# Altium schematic sheet Multi_LT_circuit.SchDoc
size A3; SheetNumber: 3; SheetTotal: 3
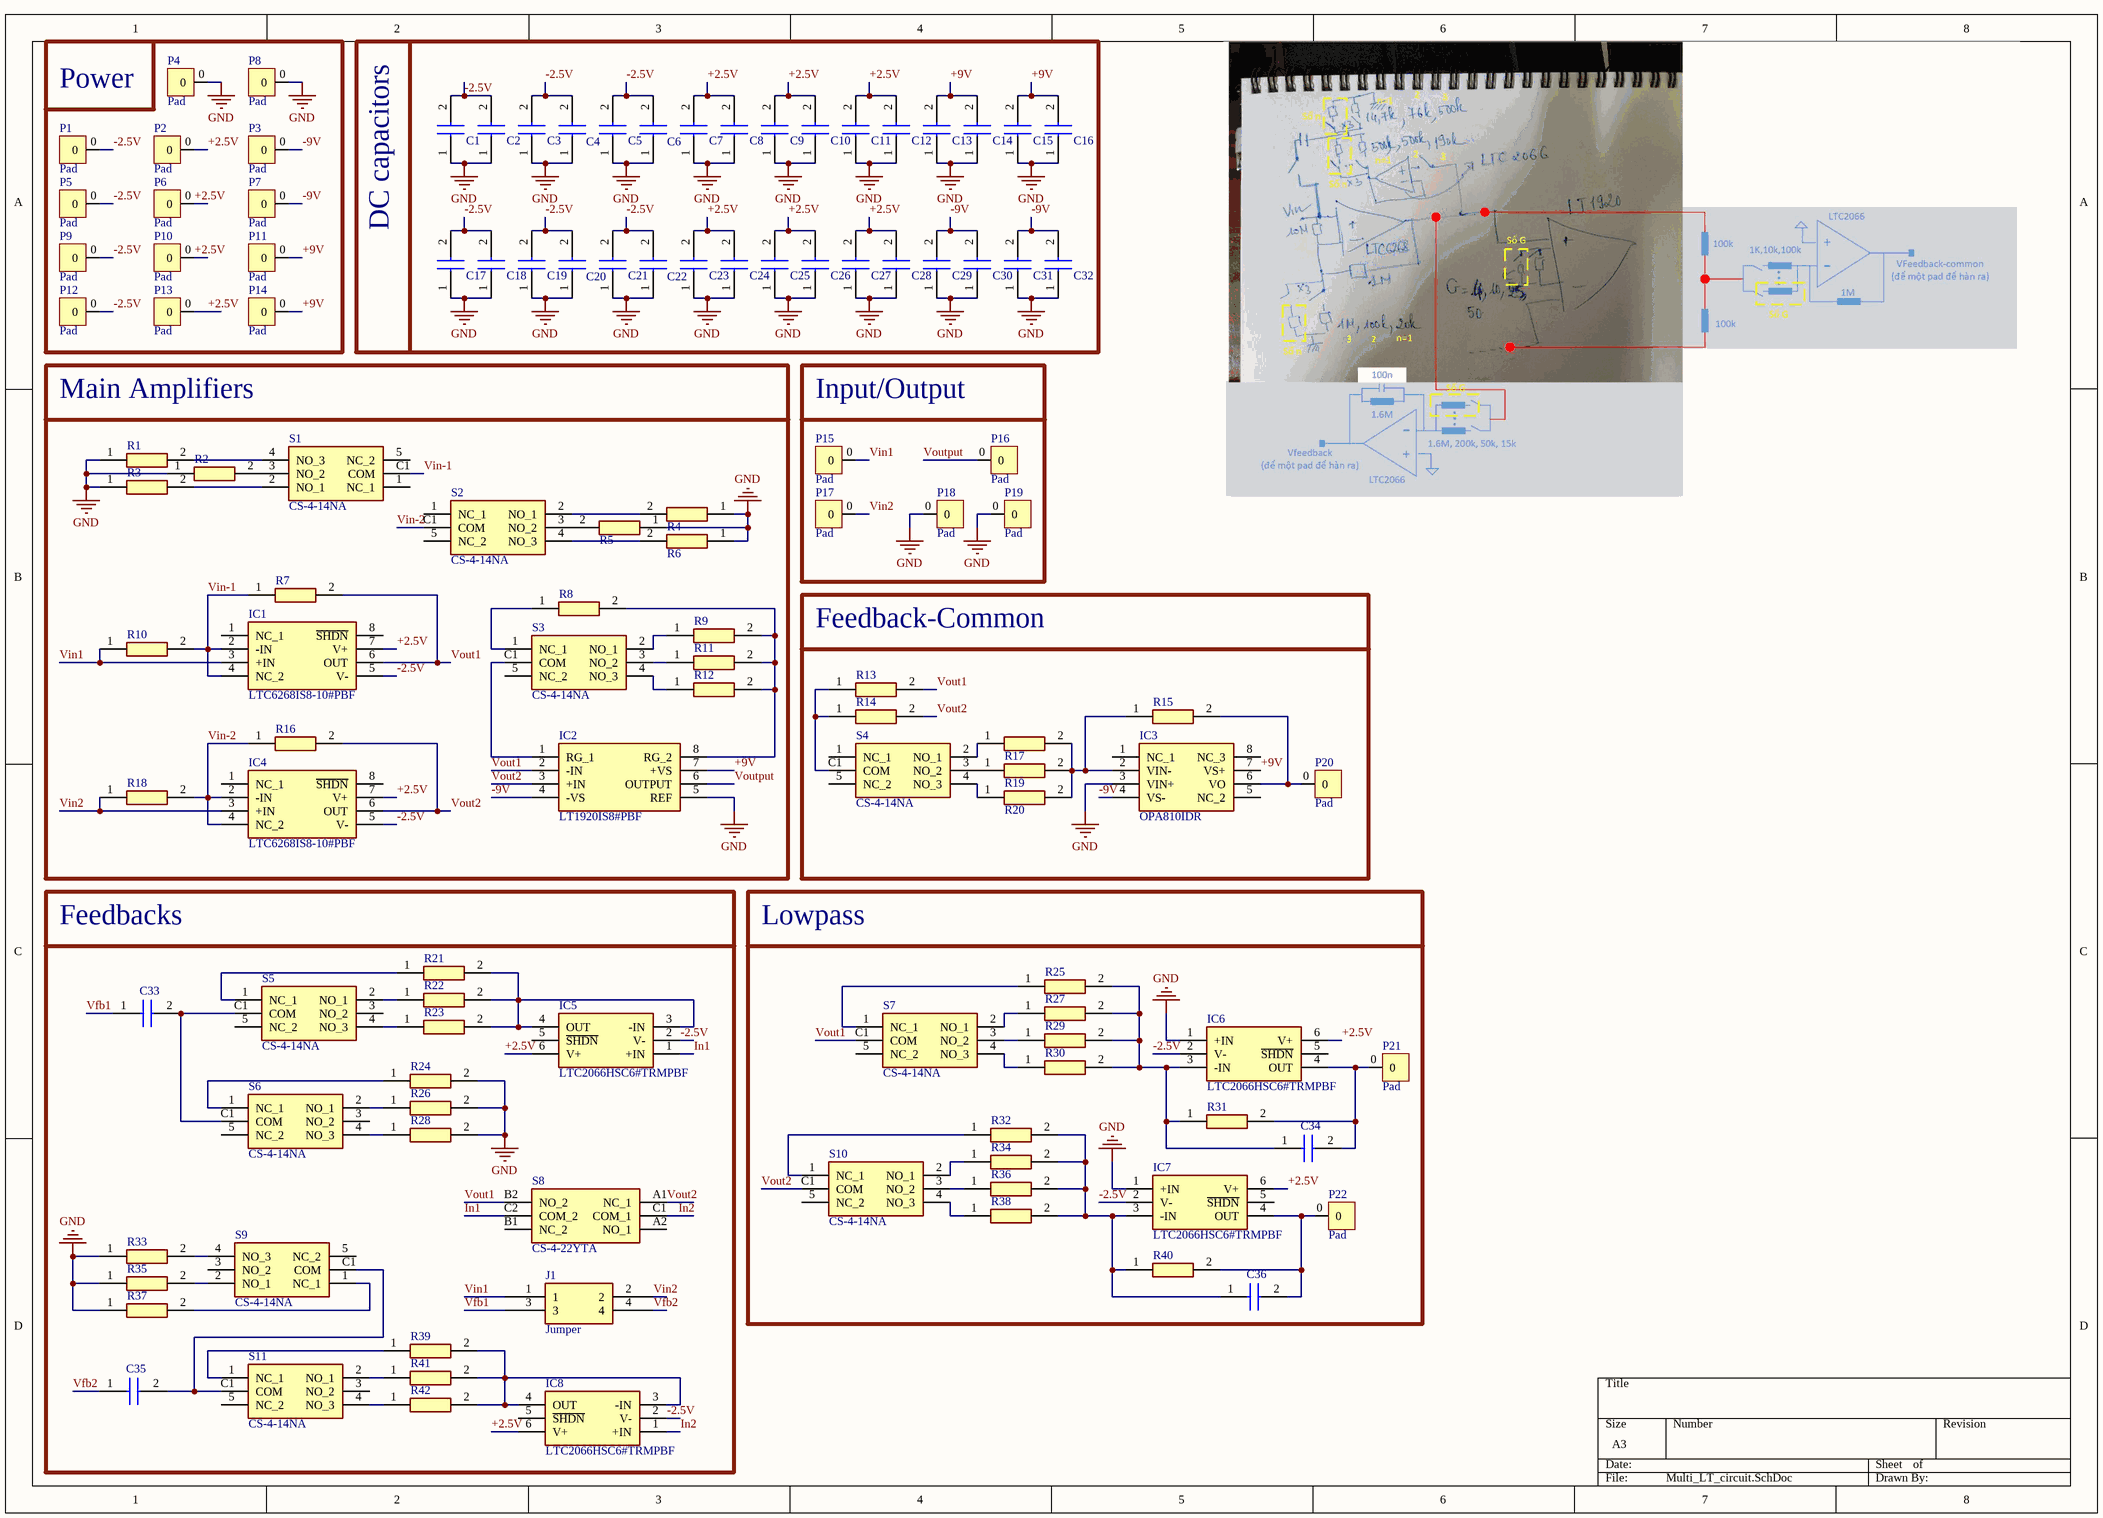
[diagram p0: Multi_LT_circuit.SchDoc]

## Parts
C1  GCM21BD70J106KE02K  [CAPC2012X140N]  (value not drawn)
C2  GCJ21BR72A104KA01K  [CAPC2012X150N]  (value not drawn)
C3  GCM21BD70J106KE02K  [CAPC2012X140N]  (value not drawn)
C4  GCJ21BR72A104KA01K  [CAPC2012X150N]  (value not drawn)
C5  GCM21BD70J106KE02K  [CAPC2012X140N]  (value not drawn)
C6  GCJ21BR72A104KA01K  [CAPC2012X150N]  (value not drawn)
C7  GCM21BD70J106KE02K  [CAPC2012X140N]  (value not drawn)
C8  GCJ21BR72A104KA01K  [CAPC2012X150N]  (value not drawn)
C9  GCM21BD70J106KE02K  [CAPC2012X140N]  (value not drawn)
C10  GCJ21BR72A104KA01K  [CAPC2012X150N]  (value not drawn)
C11  GCM21BD70J106KE02K  [CAPC2012X140N]  (value not drawn)
C12  GCJ21BR72A104KA01K  [CAPC2012X150N]  (value not drawn)
C13  GCM21BD70J106KE02K  [CAPC2012X140N]  (value not drawn)
C14  GCJ21BR72A104KA01K  [CAPC2012X150N]  (value not drawn)
C15  GCM21BD70J106KE02K  [CAPC2012X140N]  (value not drawn)
C16  GCJ21BR72A104KA01K  [CAPC2012X150N]  (value not drawn)
C17  GCM21BD70J106KE02K  [CAPC2012X140N]  (value not drawn)
C18  GCJ21BR72A104KA01K  [CAPC2012X150N]  (value not drawn)
C19  GCM21BD70J106KE02K  [CAPC2012X140N]  (value not drawn)
C20  GCJ21BR72A104KA01K  [CAPC2012X150N]  (value not drawn)
C21  GCM21BD70J106KE02K  [CAPC2012X140N]  (value not drawn)
C22  GCJ21BR72A104KA01K  [CAPC2012X150N]  (value not drawn)
C23  GCM21BD70J106KE02K  [CAPC2012X140N]  (value not drawn)
C24  GCJ21BR72A104KA01K  [CAPC2012X150N]  (value not drawn)
C25  GCM21BD70J106KE02K  [CAPC2012X140N]  (value not drawn)
C26  GCJ21BR72A104KA01K  [CAPC2012X150N]  (value not drawn)
C27  GCM21BD70J106KE02K  [CAPC2012X140N]  (value not drawn)
C28  GCJ21BR72A104KA01K  [CAPC2012X150N]  (value not drawn)
C29  GCM21BD70J106KE02K  [CAPC2012X140N]  (value not drawn)
C30  GCJ21BR72A104KA01K  [CAPC2012X150N]  (value not drawn)
C31  GCM21BD70J106KE02K  [CAPC2012X140N]  (value not drawn)
C32  GCJ21BR72A104KA01K  [CAPC2012X150N]  (value not drawn)
C33  C0805C109B3GACTU  [C0805]  (value not drawn)
C34  GCJ21BR72A104KA01K  [CAPC2012X150N]  (value not drawn)
C35  C0805C109B3GACTU  [C0805]  (value not drawn)
C36  GCJ21BR72A104KA01K  [CAPC2012X150N]  (value not drawn)
IC1  LTC6268IS8-10#PBF  [SOIC127P599X175-8N]
IC2  LT1920IS8#PBF  [SOIC127P599X175-8N]
IC3  OPA810IDR  [SOIC127P600X175-8N]
IC4  LTC6268IS8-10#PBF  [SOIC127P599X175-8N]
IC5  LTC2066HSC6#TRMPBF  [SOT65P210X100-6N]
IC6  LTC2066HSC6#TRMPBF  [SOT65P210X100-6N]
IC7  LTC2066HSC6#TRMPBF  [SOT65P210X100-6N]
IC8  LTC2066HSC6#TRMPBF  [SOT65P210X100-6N]
J1  Jumper  [Jumper 2x2]
P1  Pad  [Pad]
P2  Pad  [Pad]
P3  Pad  [Pad]
P4  Pad  [Pad]
P5  Pad  [Pad]
P6  Pad  [Pad]
P7  Pad  [Pad]
P8  Pad  [Pad]
P9  Pad  [Pad]
P10  Pad  [Pad]
P11  Pad  [Pad]
P12  Pad  [Pad]
P13  Pad  [Pad]
P14  Pad  [Pad]
P15  Pad  [Pad]
P16  Pad  [Pad]
P17  Pad  [Pad]
P18  Pad  [Pad]
P19  Pad  [Pad]
P20  Pad  [Pad]
P21  Pad  [Pad]
P22  Pad  [Pad]
R1  CRG0805F20K  [RESC2012X65N]  (value not drawn)
R2  CRG0805F100K  [RESC2012X65N]  (value not drawn)
R3  CRGH0805F1M0  [RESC2013X65N]  (value not drawn)
R4  CRG0805F20K  [RESC2012X65N]  (value not drawn)
R5  CRG0805F100K  [RESC2012X65N]  (value not drawn)
R6  CRGH0805F1M0  [RESC2013X65N]  (value not drawn)
R7  CRGH0805F1M0  [RESC2013X65N]  (value not drawn)
R8  CRGH0805F1K0  [RESC2013X65N]  (value not drawn)
R9  CRCW08052K05FKEA  [RESC2012X50N]  (value not drawn)
R10  CRGH0805J10M  [RESC2013X65N]  (value not drawn)
R11  CRCW08055K49FKEAHP  [RESC2012X60N]  (value not drawn)
R12  CRCW080516K5FKEA  [RESC2012X50N]  (value not drawn)
R13  CRG0805F100K  [RESC2012X65N]  (value not drawn)
R14  CRG0805F100K  [RESC2012X65N]  (value not drawn)
R15  CRGH0805F1M0  [RESC2013X65N]  (value not drawn)
R16  CRGH0805F1M0  [RESC2013X65N]  (value not drawn)
R17  CRG0805F100K  [RESC2012X65N]  (value not drawn)
R18  CRGH0805J10M  [RESC2013X65N]  (value not drawn)
R19  CRGH0805F10K  [RESC2013X65N]  (value not drawn)
R20  CRGH0805F1K0  [RESC2013X65N]  (value not drawn)
R21  CPF0805B499KE1  [RESC2012X65N]  (value not drawn)
R22  CPF0805B499KE1  [RESC2012X65N]  (value not drawn)
R23  CRGH0805F191K  [RESC2013X65N]  (value not drawn)
R24  CPF0805B499KE1  [RESC2012X65N]  (value not drawn)
R25  CPF0805B1M6E1  [RESC2012X65N]  (value not drawn)
R26  ERJ-6ENF7682V  [ERJ6ENF1000V]  (value not drawn)
R27  CPF-A-0805B200KE  [RESC2012X65N]  (value not drawn)
R28  CRCW080514K7FKEA  [RESC2012X50N]  (value not drawn)
R29  CPF-A-0805B49K9E1  [RESC2012X65N]  (value not drawn)
R30  CRGH0805F15K  [RESC2013X65N]  (value not drawn)
R31  CPF0805B1M6E1  [RESC2012X65N]  (value not drawn)
R32  CPF0805B1M6E1  [RESC2012X65N]  (value not drawn)
R33  CRCW080514K7FKEA  [RESC2012X50N]  (value not drawn)
R34  CPF-A-0805B200KE  [RESC2012X65N]  (value not drawn)
R35  ERJ-6ENF7682V  [ERJ6ENF1000V]  (value not drawn)
R36  CPF-A-0805B49K9E1  [RESC2012X65N]  (value not drawn)
R37  CPF0805B499KE1  [RESC2012X65N]  (value not drawn)
R38  CRGH0805F15K  [RESC2013X65N]  (value not drawn)
R39  CPF0805B499KE1  [RESC2012X65N]  (value not drawn)
R40  CPF0805B1M6E1  [RESC2012X65N]  (value not drawn)
R41  CPF0805B499KE1  [RESC2012X65N]  (value not drawn)
R42  CRGH0805F191K  [RESC2013X65N]  (value not drawn)
S1  CS-4-14NA  [CS414NA]
S2  CS-4-14NA  [CS414NA]
S3  CS-4-14NA  [CS414NA]
S4  CS-4-14NA  [CS414NA]
S5  CS-4-14NA  [CS414NA]
S6  CS-4-14NA  [CS414NA]
S7  CS-4-14NA  [CS414NA]
S8  CS-4-22YTA  [CS422YTA]
S9  CS-4-14NA  [CS414NA]
S10  CS-4-14NA  [CS414NA]
S11  CS-4-14NA  [CS414NA]

## Blocks framed on the sheet
Power: P1-P14
DC capacitors: C1-C32
Main Amplifiers: IC1 IC2 IC4 R1-R12 R16 R18 S1-S3
Input/Output: P15-P19
Feedback-Common: IC3 P20 R13-R15 R17 R19 R20 S4
Feedbacks: C33 C35 IC5 IC8 J1 R21-R24 R26 R28 R33 R35 R37 R39 R41 R42 S5 S6 S8 S9 S11
Lowpass: C34 C36 IC6 IC7 P21 P22 R25 R27 R29-R32 R34 R36 R38 R40 S7 S10

## Nets
GND: C1.1 C2.1 C3.1 C4.1 C5.1 C6.1 C7.1 C8.1 C9.1 C10.1 C11.1 C12.1 C13.1 C14.1 C15.1 C16.1 C17.1 C18.1 C19.1 C20.1 C21.1 C22.1 C23.1 C24.1 C25.1 C26.1 C27.1 C28.1 C29.1 C30.1 C31.1 C32.1 IC2.5(REF) IC3.3(VIN+) IC6.1(+IN) IC7.1(+IN) P4.0 P8.0 P18.0 P19.0 R1.1 R2.1 R3.1 R4.1 R5.1 R6.1 R24.2 R26.2 R28.2 R33.1 R35.1 R37.1
+2.5V: C7.2 C8.2 C9.2 C10.2 C11.2 C12.2 C23.2 C24.2 C25.2 C26.2 C27.2 C28.2 IC1.7(V+) IC4.7(V+) IC5.6(V+) IC6.6(V+) IC7.6(V+) IC8.6(V+) P2.0 P6.0 P10.0 P13.0
+9V: C13.2 C14.2 C15.2 C16.2 IC2.7(+VS) IC3.7(VS+) P11.0 P14.0
-2.5V: C1.2 C2.2 C3.2 C4.2 C5.2 C6.2 C17.2 C18.2 C19.2 C20.2 C21.2 C22.2 IC1.5(V-) IC4.5(V-) IC5.2(V-) IC6.2(V-) IC7.2(V-) IC8.2(V-) P1.0 P5.0 P9.0 P12.0
-9V: C29.2 C30.2 C31.2 C32.2 IC2.4(-VS) IC3.4(VS-) P3.0 P7.0
In1: IC5.1(+IN) S8.C2(COM_2)
In2: IC8.1(+IN) S8.C1(COM_1)
Vfb1: C33.1 J1.3
Vfb2: C35.1 J1.4
Vin1: IC1.3(+IN) J1.1 P15.0 R10.1
Vin2: IC4.3(+IN) J1.2 P17.0 R18.1
Vin-1: IC1.2(-IN) IC1.4(NC_2) R7.1 R10.2 S1.C1(COM)
Vin-2: IC4.2(-IN) IC4.4(NC_2) R16.1 R18.2 S2.C1(COM)
Vout1: IC1.6(OUT) IC2.2(-IN) R7.2 R13.2 S7.C1(COM) S8.B2(NO_2)
Vout2: IC2.3(+IN) IC4.6(OUT) R14.2 R16.2 S8.A1(NC_1) S10.C1(COM)
Voutput: IC2.6(OUTPUT) P16.0
NetC33_2: C33.2 S5.C1(COM) S6.C1(COM)
NetC34_1: C34.1 IC6.3(-IN) R25.2 R27.2 R29.2 R30.2 R31.1
NetC34_2: C34.2 IC6.4(OUT) P21.0 R31.2
NetC35_2: C35.2 S9.C1(COM) S11.C1(COM)
NetC36_1: C36.1 IC7.3(-IN) R32.2 R34.2 R36.2 R38.2 R40.1
NetC36_2: C36.2 IC7.4(OUT) P22.0 R40.2
NetIC2_1: IC2.1(RG_1) S3.C1(COM)
NetIC2_8: IC2.8(RG_2) R8.2 R9.2 R11.2 R12.2
NetIC3_2: IC3.2(VIN-) R15.1 R17.2 R19.2 R20.2
NetIC3_6: IC3.6(VO) P20.0 R15.2
NetIC5_3: IC5.3(-IN) IC5.4(OUT) R21.2 R22.2 R23.2
NetIC8_3: IC8.3(-IN) IC8.4(OUT) R39.2 R41.2 R42.2
NetR1_2: R1.2 S1.4(NO_3)
NetR2_2: R2.2 S1.3(NO_2)
NetR3_2: R3.2 S1.2(NO_1)
NetR4_2: R4.2 S2.2(NO_1)
NetR5_2: R5.2 S2.3(NO_2)
NetR6_2: R6.2 S2.4(NO_3)
NetR8_1: R8.1 S3.1(NC_1)
NetR9_1: R9.1 S3.2(NO_1)
NetR11_1: R11.1 S3.3(NO_2)
NetR12_1: R12.1 S3.4(NO_3)
NetR13_1: R13.1 R14.1 S4.C1(COM)
NetR17_1: R17.1 S4.2(NO_1)
NetR19_1: R19.1 S4.3(NO_2)
NetR20_1: R20.1 S4.4(NO_3)
NetR21_1: R21.1 S5.1(NC_1)
NetR22_1: R22.1 S5.2(NO_1)
NetR23_1: R23.1 S5.4(NO_3)
NetR24_1: R24.1 S6.1(NC_1)
NetR25_1: R25.1 S7.1(NC_1)
NetR26_1: R26.1 S6.2(NO_1)
NetR27_1: R27.1 S7.2(NO_1)
NetR28_1: R28.1 S6.4(NO_3)
NetR29_1: R29.1 S7.3(NO_2)
NetR30_1: R30.1 S7.4(NO_3)
NetR32_1: R32.1 S10.1(NC_1)
NetR33_2: R33.2 S9.4(NO_3)
NetR34_1: R34.1 S10.2(NO_1)
NetR35_2: R35.2 S9.2(NO_1)
NetR36_1: R36.1 S10.3(NO_2)
NetR37_2: R37.2 S9.1(NC_1)
NetR38_1: R38.1 S10.4(NO_3)
NetR39_1: R39.1 S11.1(NC_1)
NetR41_1: R41.1 S11.2(NO_1)
NetR42_1: R42.1 S11.4(NO_3)

Not connected (* = marked no-connect by the designer): IC1 1(NC_1) 8(~{SHDN}); IC3 1(NC_1) 5(NC_2) 8(NC_3); IC4 1(NC_1) 8(~{SHDN}); IC5 5(~{SHDN}); IC6 5(~{SHDN}); IC7 5(~{SHDN}); IC8 5(~{SHDN}); S1 1(NC_1) 5(NC_2); S2 1(NC_1) 5(NC_2); S3 5(NC_2); S4 1(NC_1) 5(NC_2); S5 3(NO_2) 5(NC_2); S6 3(NO_2) 5(NC_2); S7 5(NC_2); S8 A2(NO_1) B1(NC_2); S9 3(NO_2) 5(NC_2); S10 5(NC_2); S11 3(NO_2) 5(NC_2)

## Library data of the parts
C1 C3 C5 C7 C9 C11 C13 C15 C17 C19 C21 C23 C25 C27 C29 C31 = GCM21BD70J106KE02K: Capacitor 10uF; Manufacturer_Name: Murata Electronics; Datasheet Link: https://www.murata.com/en-global/api/pdfdownloadapi?cate=luCeramicCapacitorsSMD&partno=GCM21BD70J106KE02%23; Height: 1.4mm; Manufacturer_Part_Number: GCM21BD70J106KE02K; Mouser Part Number: 81-GCM21BD70J106KE2K; Mouser Price/Stock: https://www.mouser.co.uk/ProductDetail/Murata-Electronics/GCM21BD70J106KE02K?qs=ufv2HEpFn%252BR%2FX0aJNPDpRg%3D%3D; Case: 0805 (in); Mounting Style: SMD/SMT
C2 C4 C6 C8 C10 C12 C14 C16 C18 C20 C22 C24 C26 C28 C30 C32 C34 C36 = GCJ21BR72A104KA01K: Capacitor 0.1uF; Manufacturer_Name: Murata Electronics; Datasheet Link: https://psearch.en.murata.com/capacitor/product/GCJ21BR72A104KA01%23.html; Height: 1.5mm; Manufacturer_Part_Number: GCJ21BR72A104KA01K; Mouser Part Number: 81-GCJ21BR72A104KA01; Mouser Price/Stock: https://www.mouser.co.uk/ProductDetail/Murata-Electronics/GCJ21BR72A104KA01K?qs=yTuLhIm%2Fv1BqgzUieC0jrw%3D%3D; Arrow Part Number: GCJ21BR72A104KA01K; Arrow Price/Stock: https://www.arrow.com/en/products/gcj21br72a104ka01k/murata-manufacturing?region=europe; Case: 0805 (in); Mounting Style: SMD/SMT
C33 C35 = C0805C109B3GACTU: Capacitor 1pF; Manufacturer_Name: KEMET; Datasheet Link: https://content.kemet.com/datasheets/KEM_C1003_C0G_SMD.pdf; Height: 1.1mm; Manufacturer_Part_Number: C0805C109B3GACTU; Case: 0805 (in); Mounting Style: SMD/SMT
IC1 IC4 = LTC6268IS8-10#PBF: Integrated Circuit; Manufacturer_Name: Analog Devices; Datasheet Link: https://datasheet.datasheetarchive.com/originals/distributors/Datasheets_SAMA/eb0bf5824ac521a4901f543e1202dae7.pdf; Height: 1.752mm; Manufacturer_Part_Number: LTC6268IS8-10#PBF; Mouser Part Number: 584-LTC6268IS8-10PBF; Mouser Price/Stock: https://www.mouser.co.uk/ProductDetail/Analog-Devices/LTC6268IS8-10PBF?qs=oahfZPh6IAJW%252BkNj5oLlfA%3D%3D; Arrow Part Number: LTC6268IS8-10#PBF; Arrow Price/Stock: https://www.arrow.com/en/products/ltc6268is8-10pbf/analog-devices?region=nac; Case: SOIC-8; Mounting Style: SMD/SMT
IC2 = LT1920IS8#PBF: Integrated Circuit; Manufacturer_Name: Analog Devices; Datasheet Link: https://datasheet.datasheetarchive.com/originals/distributors/SFDatasheet-4/sf-00091026.pdf; Height: 1.752mm; Manufacturer_Part_Number: LT1920IS8#PBF; Mouser Part Number: 584-LT1920IS8#PBF; Mouser Price/Stock: https://www.mouser.co.uk/ProductDetail/Analog-Devices/LT1920IS8PBF?qs=ytflclh7QUWOSod6PqfjSg%3D%3D; Arrow Part Number: LT1920IS8#PBF; Arrow Price/Stock: https://www.arrow.com/en/products/lt1920is8pbf/analog-devices?region=nac; Case: SOIC-8; Mounting Style: SMD/SMT
IC3 = OPA810IDR: Integrated Circuit; Manufacturer_Name: Texas Instruments; Datasheet Link: https://www.ti.com/lit/ds/symlink/opa810.pdf; Height: 1.75mm; Manufacturer_Part_Number: OPA810IDR; Mouser Part Number: 595-OPA810IDR; Mouser Price/Stock: https://www.mouser.co.uk/ProductDetail/Texas-Instruments/OPA810IDR?qs=ToK3%2FczOkx8EaDuN35bMdg%3D%3D; Arrow Part Number: OPA810IDR; Arrow Price/Stock: https://www.arrow.com/en/products/opa810idr/texas-instruments?region=nac; Case: SOIC-8; Mounting Style: SMD/SMT
IC5-IC8 = LTC2066HSC6#TRMPBF: Integrated Circuit; Manufacturer_Name: Analog Devices; Datasheet Link: https://www.analog.com/media/en/technical-documentation/data-sheets/LTC2066-2067.pdf; Height: 1mm; Manufacturer_Part_Number: LTC2066HSC6#TRMPBF; Mouser Part Number: 584-LTC2066HSC6TRMPB; Mouser Price/Stock: https://www.mouser.co.uk/ProductDetail/Analog-Devices/LTC2066HSC6TRMPBF?qs=W0yvOO0ixfHn5Jrn%2FV4Xwg%3D%3D; Arrow Part Number: LTC2066HSC6#TRMPBF; Arrow Price/Stock: https://www.arrow.com/en/products/ltc2066hsc6trmpbf/analog-devices; Case: SC-70-6; Mounting Style: SMD/SMT
R1 R4 = CRG0805F20K: Resistor 20k; Manufacturer_Name: TE Connectivity; Parameter 1: SMD/SMT; Datasheet Link: http://www.te.com/commerce/DocumentDelivery/DDEController?Action=showdoc&DocId=Customer+Drawing%7F1623109%7FBA%7Fpdf%7FEnglish%7FENG_CD_1623109_BA.pdf%7F1623109-1; Height: 0.65mm; Manufacturer_Part_Number: CRG0805F20K; Mouser Part Number: 279-CRG0805F20K; Mouser Price/Stock: https://www.mouser.co.uk/ProductDetail/TE-Connectivity-Holsworthy/CRG0805F20K?qs=o1jQnaWw5FTLjD3rzUcvvQ%3D%3D; Case: 0805 (in)
R2 R5 R13 R14 R17 = CRG0805F100K: Resistor 100k; Manufacturer_Name: TE Connectivity; Datasheet Link: http://www.te.com/commerce/DocumentDelivery/DDEController?Action=showdoc&DocId=Customer+Drawing%7F1623109%7FBA%7Fpdf%7FEnglish%7FENG_CD_1623109_BA.pdf%7F1623109-1; Height: 0.65mm; Manufacturer_Part_Number: CRG0805F100K; Mouser Part Number: 279-CRG0805F100K; Mouser Price/Stock: https://www.mouser.co.uk/ProductDetail/TE-Connectivity-Holsworthy/CRG0805F100K?qs=VHcS2MTj4gaSH6styLNYqg%3D%3D; Arrow Part Number: CRG0805F100K; Arrow Price/Stock: https://www.arrow.com/en/products/crg0805f100k/te-connectivity?region=nac; Case: 0805 (in); Mounting Style: SMD/SMT
R3 R6 R7 R15 R16 = CRGH0805F1M0: Resistor 1M; Manufacturer_Name: TE Connectivity; Datasheet Link: http://docs-europe.electrocomponents.com/webdocs/12d7/0900766b812d7379.pdf; Height: 0.65mm; Manufacturer_Part_Number: CRGH0805F1M0; Mouser Part Number: 279-CRGH0805F1M0; Mouser Price/Stock: https://www.mouser.co.uk/ProductDetail/TE-Connectivity-Holsworthy/CRGH0805F1M0?qs=n4i9pByFsMQTrmSXKnTEpA%3D%3D; Arrow Part Number: CRGH0805F1M0; Arrow Price/Stock: https://www.arrow.com/en/products/crgh0805f1m0/te-connectivity; Case: 0805 (in); Mounting Style: SMD/SMT
R8 R20 = CRGH0805F1K0: Resistor 1k; Manufacturer_Name: TE Connectivity; Datasheet Link: http://docs-europe.electrocomponents.com/webdocs/12d7/0900766b812d7379.pdf; Height: 0.65mm; Manufacturer_Part_Number: CRGH0805F1K0; Mouser Part Number: 279-CRGH0805F1K0; Mouser Price/Stock: https://www.mouser.co.uk/ProductDetail/TE-Connectivity-Holsworthy/CRGH0805F1K0?qs=n4i9pByFsMSWm5mr6nHHgQ%3D%3D; Arrow Part Number: CRGH0805F1K0; Arrow Price/Stock: https://www.arrow.com/en/products/crgh0805f1k0/te-connectivity?region=nac; Case: 0805 (in); Mounting Style: SDM/SMT
R9 = CRCW08052K05FKEA: Resistor 2.05k; Manufacturer_Name: Vishay; Datasheet Link: http://www.vishay.com/docs/20035/dcrcwe3.pdf; Height: 0.5mm; Manufacturer_Part_Number: CRCW08052K05FKEA; Mouser Part Number: 71-CRCW0805-2.05K-E3; Case: 0805 (in); Mounting Style: SMD/SMT
R10 R18 = CRGH0805J10M: Resistor 10M; Manufacturer_Name: TE Connectivity; Datasheet Link: http://docs-europe.electrocomponents.com/webdocs/12d7/0900766b812d7379.pdf; Height: 0.65mm; Manufacturer_Part_Number: CRGH0805J10M; Mouser Part Number: 279-CRGH0805J10M; Mouser Price/Stock: https://www.mouser.co.uk/ProductDetail/TE-Connectivity-Holsworthy/CRGH0805J10M?qs=s1WWODT2SXVlIm5RdQkQ6A%3D%3D; Case: 0805 (in); Mounting Style: SMD/SMT
R11 = CRCW08055K49FKEAHP: Resistor 5.49k; Manufacturer_Name: Vishay; Datasheet Link: https://componentsearchengine.com/Datasheets/1/CRCW08051R00FKEAHP.pdf; Height: 0.6mm; Manufacturer_Part_Number: CRCW08055K49FKEAHP; Case: 0805 (in); Mounting Style: SMD/SMT
R12 = CRCW080516K5FKEA: Resistor 16.5k; Manufacturer_Name: Vishay; Datasheet Link: http://www.vishay.com/docs/20035/dcrcwe3.pdf; Height: 0.5mm; Manufacturer_Part_Number: CRCW080516K5FKEA; Mouser Part Number: 71-CRCW0805-16.5K-E3; Case: 0805 (in); Mounting Style: SMD/SMT
R19 = CRGH0805F10K: Resistor 10k; Manufacturer_Name: TE Connectivity; Datasheet Link: http://docs-europe.electrocomponents.com/webdocs/12d7/0900766b812d7379.pdf; Height: 0.65mm; Manufacturer_Part_Number: CRGH0805F10K; Mouser Part Number: 279-CRGH0805F10K; Mouser Price/Stock: https://www.mouser.co.uk/ProductDetail/TE-Connectivity-Holsworthy/CRGH0805F10K?qs=HLeXuo0aL2p58CY%2FK%252BmPjw%3D%3D; Arrow Part Number: CRGH0805F10K; Arrow Price/Stock: https://www.arrow.com/en/products/crgh0805f10k/te-connectivity; Case: 0805 (in); Mounting Style: SMD/SMT
R21 R22 R24 R37 R39 R41 = CPF0805B499KE1: Resistor 499k; Manufacturer_Name: TE Connectivity; Datasheet Link: http://docs-europe.electrocomponents.com/webdocs/13d1/0900766b813d116f.pdf; Height: 0.65mm; Manufacturer_Part_Number: CPF0805B499KE1; Mouser Part Number: 279-CPF0805B499KE1; Mouser Price/Stock: https://www.mouser.com/Search/Refine.aspx?Keyword=279-CPF0805B499KE1; Arrow Part Number: CPF0805B499KE1; Arrow Price/Stock: https://www.arrow.com/en/products/cpf0805b499ke1/te-connectivity; Case: 0805 (in); Mounting Style: SMD/SMT
R23 R42 = CRGH0805F191K: Resistor 191k; Manufacturer_Name: TE Connectivity; Datasheet Link: http://docs-europe.electrocomponents.com/webdocs/12d7/0900766b812d7379.pdf; Height: 0.65mm; Manufacturer_Part_Number: CRGH0805F191K; Mouser Part Number: 279-CRGH0805F191K; Mouser Price/Stock: https://www.mouser.co.uk/ProductDetail/TE-Connectivity-Neohm/CRGH0805F191K?qs=8G8kQhBkhGgT%2F02BvhuEeQ%3D%3D; Case: 0805 (in); Mounting Style: SMD/SMT
R25 R31 R32 R40 = CPF0805B1M6E1: Resistor 1.6M; Manufacturer_Name: TE Connectivity; Datasheet Link: http://docs-europe.electrocomponents.com/webdocs/13d1/0900766b813d116f.pdf; Height: 0.65mm; Manufacturer_Part_Number: CPF0805B1M6E1; Mouser Part Number: 279-CPF0805B1M6E1; Mouser Price/Stock: https://www.mouser.co.uk/ProductDetail/TE-Connectivity-Holsworthy/CPF0805B1M6E1?qs=5Dj%252BCDyFp7gud0VX0vRDmw%3D%3D; Case: 0805 (in); Mounting Style: SMD/SMT
R26 R35 = ERJ-6ENF7682V: Resistor 76.8k; Manufacturer_Name: Panasonic; Datasheet Link: https://industrial.panasonic.com/cdbs/www-data/pdf/RDA0000/AOA0000C84.pdf; Height: 0.7mm; Manufacturer_Part_Number: ERJ-6ENF7682V; Mouser Part Number: 667-ERJ-6ENF7682V; Mouser Price/Stock: https://www.mouser.com/Search/Refine.aspx?Keyword=667-ERJ-6ENF7682V; Case: 0805 (in); Mounting Style: SMD/SMT
R27 R34 = CPF-A-0805B200KE: Resistor 200k; Manufacturer_Name: TE Connectivity; Datasheet Link: https://www.mouser.in/datasheet/2/418/5/ENG_DS_1773200_1_A-847523.pdf; Height: 0.65mm; Manufacturer_Part_Number: CPF-A-0805B200KE; Mouser Part Number: 279-CPF-A-0805B200KE; Mouser Price/Stock: https://www.mouser.co.uk/ProductDetail/TE-Connectivity/CPF-A-0805B200KE?qs=chTDxNqvsympgoiwwdg80g%3D%3D; Case: 0805 (in); Mounting Style: SMD/SMT
R28 R33 = CRCW080514K7FKEA: Resistor 14.7k; Manufacturer_Name: Vishay; Datasheet Link: http://www.vishay.com/docs/20035/dcrcwe3.pdf; Height: 0.5mm; Manufacturer_Part_Number: CRCW080514K7FKEA; Mouser Part Number: 71-CRCW0805-14.7K-E3; Mouser Price/Stock: https://www.mouser.co.uk/ProductDetail/Vishay-Dale/CRCW080514K7FKEA?qs=bMjB6bAaLENHHnllsz%252BSXA%3D%3D; Arrow Part Number: CRCW080514K7FKEA; Arrow Price/Stock: https://www.arrow.com/en/products/crcw080514k7fkea/vishay?region=nac; Case: 0805 (in); Mounting Style: SMD/SMT
R29 R36 = CPF-A-0805B49K9E1: Resistor 49.9k; Manufacturer_Name: TE Connectivity; Datasheet Link: https://www.te.com/commerce/DocumentDelivery/DDEController?Action=showdoc&DocId=Data+Sheet%7F1773200-1%7FB%7Fpdf%7FEnglish%7FENG_DS_1773200-1_B.pdf%7F6-2176217-4; Height: 0.65mm; Manufacturer_Part_Number: CPF-A-0805B49K9E1; Mouser Part Number: 279-CPF-A0805B49K9E1; Mouser Price/Stock: https://www.mouser.vn/ProductDetail/TE-Connectivity-Holsworthy/CPF-A-0805B49K9E1?qs=sGAEpiMZZMtlubZbdhIBILA%2F3gb4ZcwrSl2lU3bSvkw%3D; Case: 0805 (in); Mounting Style: SMD/SMT
R30 R38 = CRGH0805F15K: Resistor 15k; Manufacturer_Name: TE Connectivity; Datasheet Link: http://docs-europe.electrocomponents.com/webdocs/12d7/0900766b812d7379.pdf; Height: 0.65mm; Manufacturer_Part_Number: CRGH0805F15K; Mouser Part Number: 279-CRGH0805F15K; Mouser Price/Stock: https://www.mouser.co.uk/ProductDetail/TE-Connectivity-Holsworthy/CRGH0805F15K?qs=n4i9pByFsMSabXcbjCkahQ%3D%3D; Case: 0805 (in); Mounting Style: SMD/SMT
S1-S7 S9-S11 = CS-4-14NA: Switch; Manufacturer_Name: Nidec Components; Datasheet Link: https://www.nidec-components.com/e/catalog/switch/cs-4.pdf; Height: 2.6mm; Manufacturer_Part_Number: CS-4-14NA; Mouser Part Number: 229-CS-4-14NA; Mouser Price/Stock: https://www.mouser.co.uk/ProductDetail/Nidec-Components/CS-4-14NA?qs=XeJtXLiO41SJhPXQmbZZMw%3D%3D; Mounting Style: SMD/SMT
S8 = CS-4-22YTA: Switch; Manufacturer_Name: Copal Electronics; Datasheet Link: https://www.nidec-copal-electronics.com/e/catalog/switch/cs-4.pdf; Height: 2.6mm; Manufacturer_Part_Number: CS-4-22YTA; Mouser Part Number: 229-CS-4-22YTA; Mouser Price/Stock: https://www.mouser.co.uk/ProductDetail/Nidec-Components/CS-4-22YTA?qs=XeJtXLiO41RMhjAhvBd3rw%3D%3D; Mounting Style: SMD/SMT